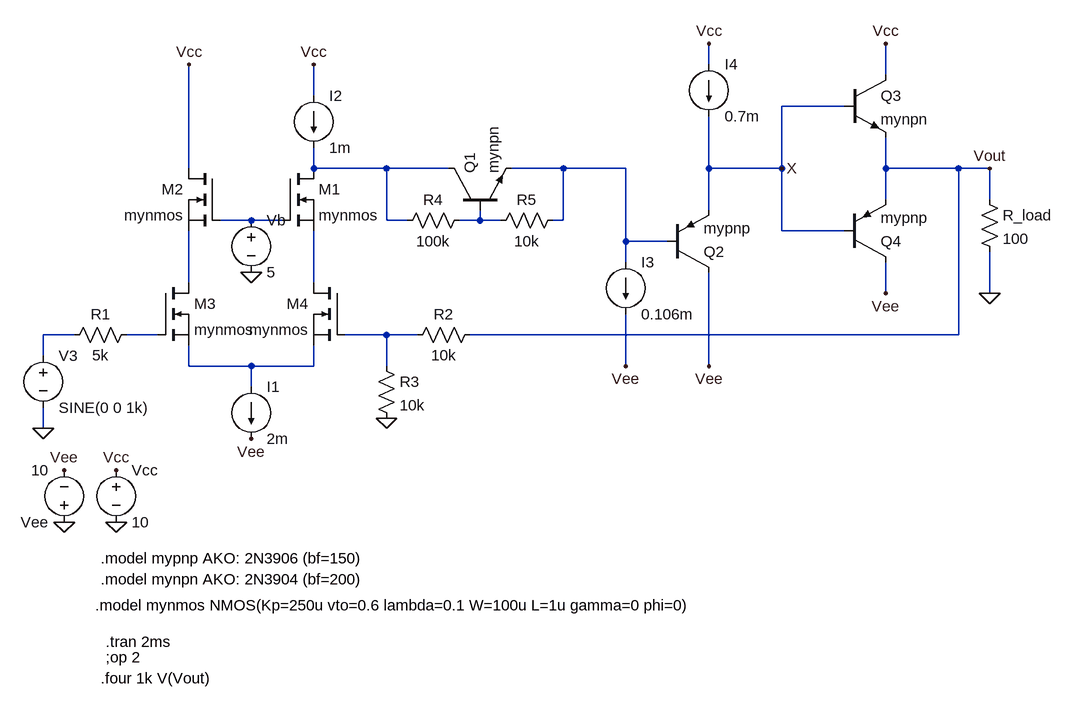
[diagram p0: schematic elec2_3.asc]
elec2_3.asc, the LTspice schematic file:
Version 4
SHEET 1 1552 912
WIRE -80 -48 -80 -80
WIRE 192 -32 192 -80
WIRE -688 0 -688 -48
WIRE 128 16 32 16
WIRE -880 112 -880 -48
WIRE -688 112 -688 80
WIRE -576 112 -688 112
WIRE -480 112 -576 112
WIRE -304 112 -384 112
WIRE -208 112 -304 112
WIRE -80 112 -80 32
WIRE 32 112 32 16
WIRE 32 112 -80 112
WIRE 192 112 192 64
WIRE 304 112 192 112
WIRE 352 112 304 112
WIRE 192 160 192 112
WIRE 352 160 352 112
WIRE -80 176 -80 112
WIRE -784 192 -832 192
WIRE -736 192 -784 192
WIRE -576 192 -576 112
WIRE -544 192 -576 192
WIRE -432 192 -432 176
WIRE -432 192 -464 192
WIRE -400 192 -432 192
WIRE -304 192 -304 112
WIRE -304 192 -320 192
WIRE 32 208 32 112
WIRE 128 208 32 208
WIRE -208 224 -208 112
WIRE -144 224 -208 224
WIRE -208 256 -208 224
WIRE -880 288 -880 208
WIRE -688 288 -688 208
WIRE 192 304 192 256
WIRE 352 304 352 240
WIRE -1056 368 -1104 368
WIRE -928 368 -976 368
WIRE -576 368 -640 368
WIRE -528 368 -576 368
WIRE 304 368 304 112
WIRE 304 368 -448 368
WIRE -1104 400 -1104 368
WIRE -880 416 -880 384
WIRE -784 416 -880 416
WIRE -688 416 -688 384
WIRE -688 416 -784 416
WIRE -576 416 -576 368
WIRE -208 416 -208 336
WIRE -80 416 -80 272
WIRE -784 448 -784 416
WIRE -1104 512 -1104 480
FLAG 352 304 0
FLAG -992 656 0
FLAG -1072 656 0
FLAG -992 576 Vcc
FLAG -1072 576 Vee
FLAG 192 -80 Vcc
FLAG 192 304 Vee
FLAG -880 -48 Vcc
FLAG -688 -48 Vcc
FLAG -80 -80 Vcc
FLAG -784 528 Vee
FLAG -80 416 Vee
FLAG -576 496 0
FLAG -208 416 Vee
FLAG -1104 512 0
FLAG 32 112 X
FLAG 352 112 Vout
FLAG -784 272 0
SYMBOL npn 128 -32 R0
SYMATTR InstName Q3
SYMATTR Value mynpn
SYMBOL pnp 128 256 M180
SYMATTR InstName Q4
SYMATTR Value mypnp
SYMBOL res 336 144 R0
SYMATTR InstName R_load
SYMATTR Value 100
SYMBOL voltage -992 560 R0
WINDOW 123 0 0 Left 0
WINDOW 39 0 0 Left 0
SYMATTR InstName Vcc
SYMATTR Value 10
SYMBOL voltage -1072 672 R180
WINDOW 123 0 0 Left 0
WINDOW 39 0 0 Left 0
SYMATTR InstName Vee
SYMATTR Value 10
SYMBOL current -80 -48 R0
WINDOW 123 0 0 Left 0
WINDOW 39 0 0 Left 0
SYMATTR InstName I4
SYMATTR Value 0.7m
SYMBOL pnp -144 272 M180
SYMATTR InstName Q2
SYMATTR Value mypnp
SYMBOL res -304 176 R90
WINDOW 0 0 56 VBottom 2
WINDOW 3 32 56 VTop 2
SYMATTR InstName R5
SYMATTR Value 10k
SYMBOL npn -480 176 R270
SYMATTR InstName Q1
SYMATTR Value mynpn
SYMBOL res -448 176 R90
WINDOW 0 0 56 VBottom 2
WINDOW 3 32 56 VTop 2
SYMATTR InstName R4
SYMATTR Value 100k
SYMBOL current -688 0 R0
WINDOW 123 0 0 Left 0
WINDOW 39 0 0 Left 0
SYMATTR InstName I2
SYMATTR Value 1m
SYMBOL nmos -736 112 R0
SYMATTR InstName M1
SYMATTR Value mynmos
SYMBOL nmos -832 112 M0
SYMATTR InstName M2
SYMATTR Value mynmos
SYMBOL nmos -640 288 M0
SYMATTR InstName M4
SYMATTR Value mynmos
SYMBOL nmos -928 288 R0
SYMATTR InstName M3
SYMATTR Value mynmos
SYMBOL current -784 448 R0
WINDOW 123 0 0 Left 0
WINDOW 39 0 0 Left 0
SYMATTR InstName I1
SYMATTR Value 2m
SYMBOL res -592 400 R0
SYMATTR InstName R3
SYMATTR Value 10k
SYMBOL res -432 352 R90
WINDOW 0 0 56 VBottom 2
WINDOW 3 32 56 VTop 2
SYMATTR InstName R2
SYMATTR Value 10k
SYMBOL current -208 256 R0
WINDOW 123 0 0 Left 0
WINDOW 39 0 0 Left 0
SYMATTR InstName I3
SYMATTR Value 0.106m
SYMBOL res -960 352 R90
WINDOW 0 0 56 VBottom 2
WINDOW 3 32 56 VTop 2
SYMATTR InstName R1
SYMATTR Value 5k
SYMBOL voltage -1104 384 R0
WINDOW 123 0 0 Left 0
WINDOW 39 0 0 Left 0
SYMATTR InstName V3
SYMATTR Value SINE(0 0 1k)
SYMBOL voltage -784 176 R0
SYMATTR InstName Vb
SYMATTR Value 5
TEXT -1008 840 Left 2 !.tran 2ms
TEXT -1016 712 Left 2 !.model mypnp AKO: 2N3906 (bf=150)
TEXT -1016 744 Left 2 !.model mynpn AKO: 2N3904 (bf=200)
TEXT -1008 864 Left 2 !;op 2
TEXT -1024 784 Left 2 !.model mynmos NMOS(Kp=250u vto=0.6 lambda=0.1 W=100u L=1u gamma=0 phi=0)
TEXT -1016 896 Left 2 !.four 1k V(Vout)

The netlist it stands for:
* elec2_3.asc
Q3 Vcc X Vout 0 mynpn
Q4 Vee X Vout 0 mypnp
R_load Vout 0 100
Vcc Vcc 0 10
Vee 0 Vee 10
I4 Vcc X 0.7m
Q2 Vee N002 X 0 mypnp
R5 N002 N004 10k
Q1 N001 N004 N002 0 mynpn
R4 N004 N001 100k
I2 Vcc N001 1m
M1 N001 N003 N006 N006 mynmos
M2 Vcc N003 N005 N005 mynmos
M4 N006 N009 N010 N010 mynmos
M3 N005 N008 N010 N010 mynmos
I1 N010 Vee 2m
R3 N009 0 10k
R2 Vout N009 10k
I3 N002 Vee 0.106m
R1 N008 N007 5k
V3 N007 0 SINE(0 0 1k)
Vb N003 0 5
.model NPN NPN
.model PNP PNP
.lib standard.bjt
.model NMOS NMOS
.model PMOS PMOS
.lib standard.mos
.tran 2ms
.model mypnp AKO: 2N3906 (bf=150)
.model mynpn AKO: 2N3904 (bf=200)
;op 2
.model mynmos NMOS(Kp=250u vto=0.6 lambda=0.1 W=100u L=1u gamma=0 phi=0)
.four 1k V(Vout)
.backanno
.end